# EAGLE design Rwanda-AC-CurrentSense (EAGLE 9.6.2)
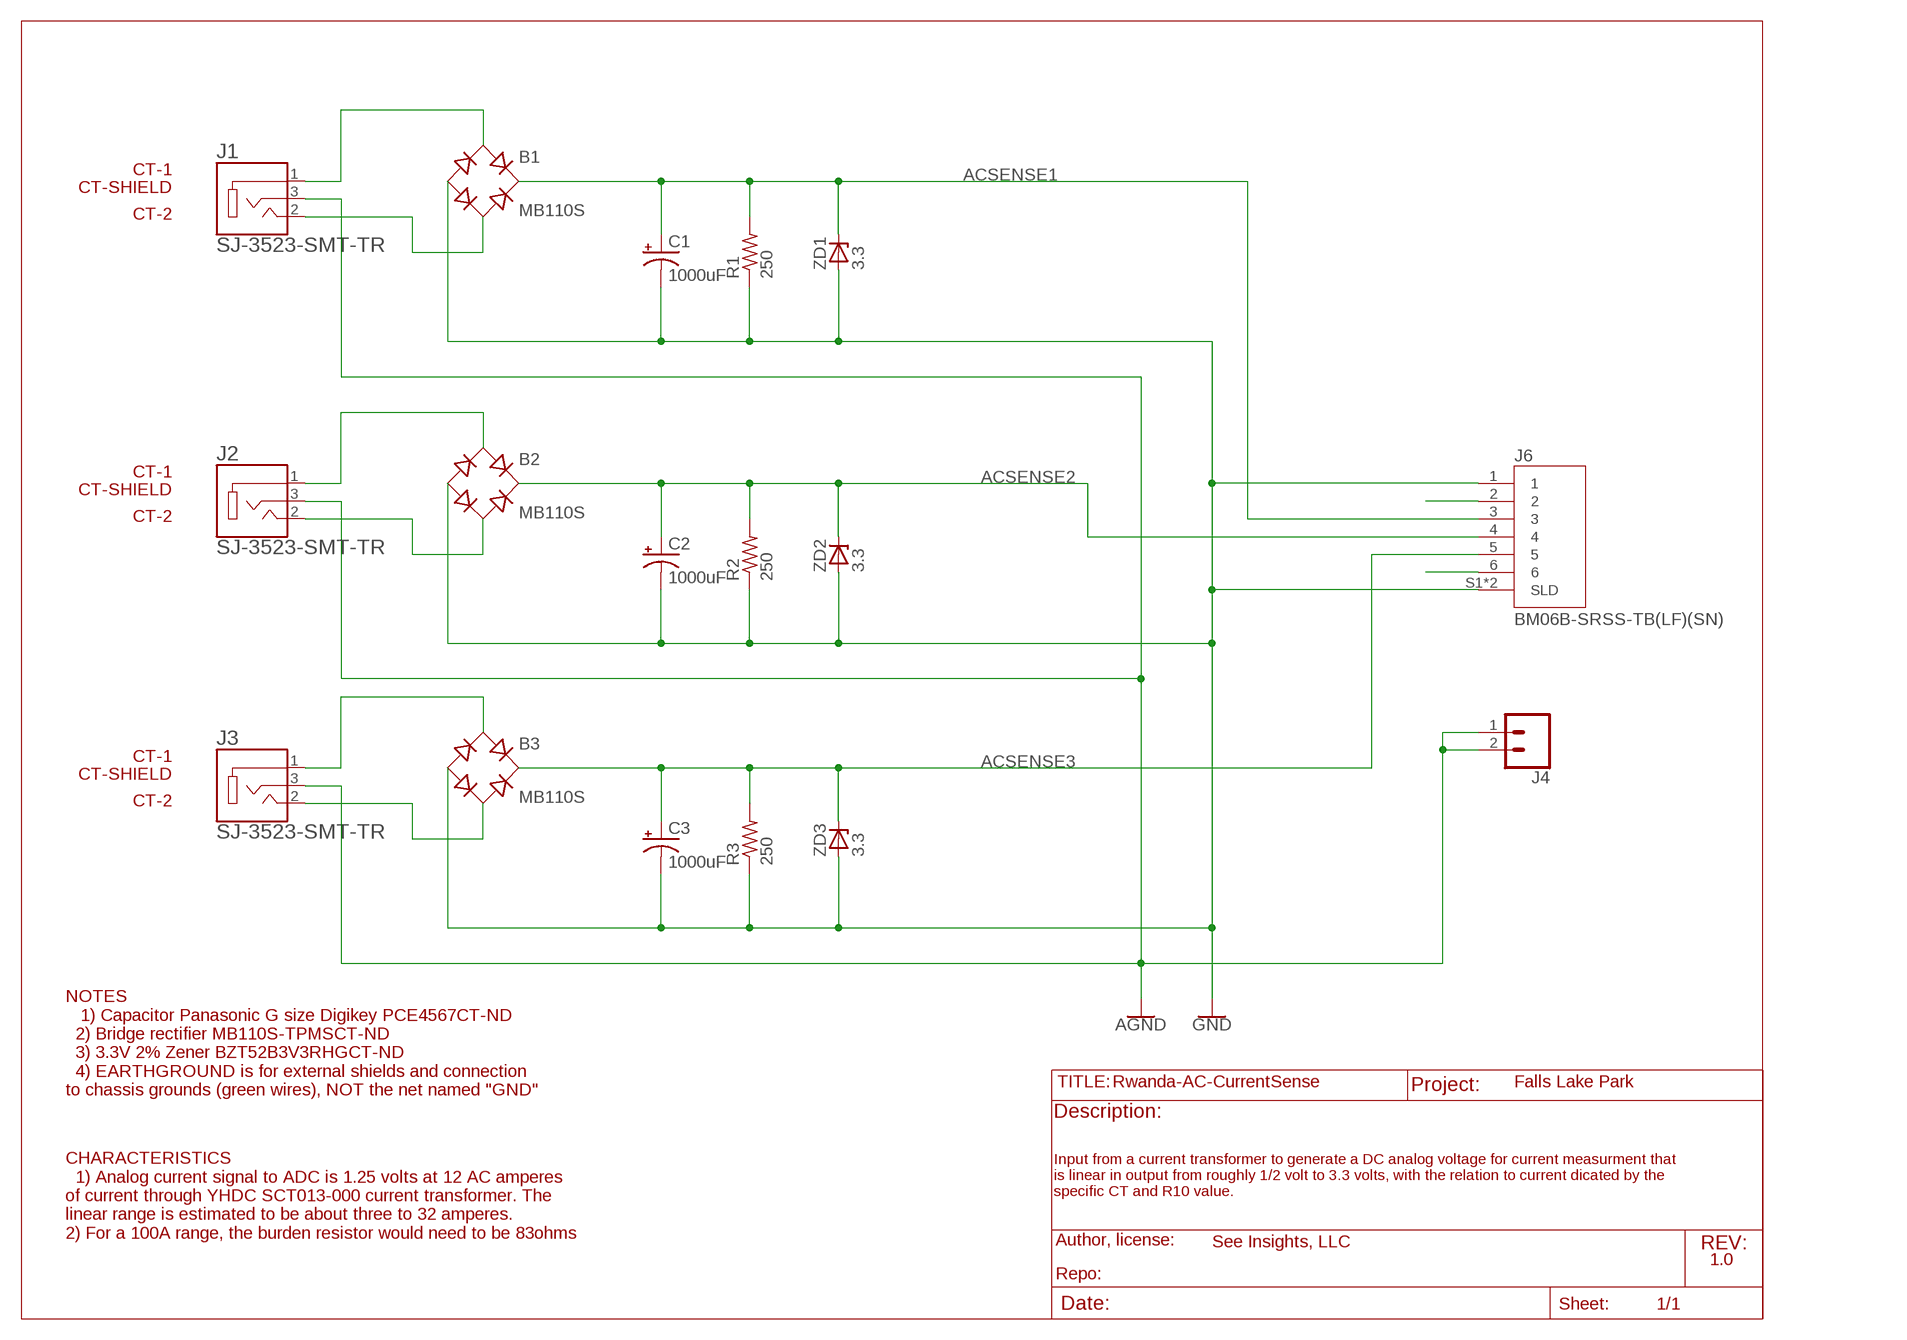
[diagram p0: schematic, sheet 1]

## Parts
B1  MB110S  MB1S  [SOIC-4]
B2  MB110S  MB1S  [SOIC-4]
B3  MB110S  MB1S  [SOIC-4]
C1  1000uF  CPOL-USG  [PANASONIC_G]
C2  1000uF  CPOL-USG  [PANASONIC_G]
C3  1000uF  CPOL-USG  [PANASONIC_G]
J1  SJ-3523-SMT-TR  [CUI_SJ-3523-SMT-TR]
J2  SJ-3523-SMT-TR  [CUI_SJ-3523-SMT-TR]
J3  SJ-3523-SMT-TR  [CUI_SJ-3523-SMT-TR]
J4  CONN_02  [1X02]
J6  BM06B-SRSS-TB(LF)(SN)  [JST_BM06B-SRSS-TB(LF)(SN)]
R1  250  R-US_M1206  [M1206]
R2  250  R-US_M1206  [M1206]
R3  250  R-US_M1206  [M1206]
ZD1  3.3  ZD-SOD123  [SOD123]
ZD2  3.3  ZD-SOD123  [SOD123]
ZD3  3.3  ZD-SOD123  [SOD123]

## Nets
ACSENSE1: B1.+ C1.+ J6.3 R1.2 ZD1.C
ACSENSE2: B2.+ C2.+ J6.4 R2.2 ZD2.C
ACSENSE3: B3.+ C3.+ J6.5 R3.2 ZD3.C
GND: B1.- B2.- B3.- C1.- C2.- C3.- J6.1 J6.S1(SLD) J6.S2(SLD) R1.1 R2.1 R3.1 ZD1.A ZD2.A ZD3.A
N$2: B2.~2(AC2) J2.2
N$4: B2.~1(AC1) J2.1
N$6: B1.~2(AC2) J1.2
N$7: B1.~1(AC1) J1.1
N$11: B3.~2(AC2) J3.2
N$12: B3.~1(AC1) J3.1
N$15: J6.2
N$19: J6.6
SHEILD: J1.3 J2.3 J3.3 J4.1 J4.2 ; supply symbol labelled AGND

## Notes on the sheet
- CT-1
- CT-SHIELD
- CT-2
- CT-1
- CT-SHIELD
- CT-2
- CT-1
- CT-SHIELD
- CT-2
- Falls Lake Park
- NOTES
     1) Capacitor Panasonic G size Digikey PCE4567CT-ND
    2) Bridge rectifier MB110S-TPMSCT-ND
    3) 3.3V 2% Zener BZT52B3V3RHGCT-ND
    4) EARTHGROUND is for external shields and connection
  to chassis grounds (green wires), NOT the net named "GND"
- CHARACTERISTICS
    1) Analog current signal to ADC is 1.25 volts at 12 AC amperes
  of current through YHDC SCT013-000 current transformer. The
  linear range is estimated to be about three to 32 amperes.
  2) For a 100A range, the burden resistor would need to be 83ohms
- Input from a current transformer to generate a DC analog voltage for current measurment that
  is linear in output from roughly 1/2 volt to 3.3 volts, with the relation to current dicated by the 
  specific CT and R10 value.
- See Insights, LLC
- 1.0

## Library data of the parts
B1 = rectifier:MB*S: Bridge Rectifier Source: http://www.fairchildsemi.com/ds/MB/MB6S.pdf; MPN: MB1S; POPULATE: 1
B2 B3 = rectifier:MB*S: Bridge Rectifier Source: http://www.fairchildsemi.com/ds/MB/MB6S.pdf
C1-C3 = adafruit:CPOL-US: POLARIZED CAPACITOR, American symbol
J1-J3 = SJ-3523-SMT-TR:SJ-3523-SMT-TR: Audio Jack Connector 3.5 mm Low Profile Surface Mount Stereo Jack, 3 Pin Right-Angle; CUI_PURCHASE_URL: https://www.cui.com/product/interconnect/audio-connectors/3.5-mm-jacks/sj-352x-smt-series?utm_source=snapeda.com&utm_medium=referral&utm_campaign=snapedaBOM; DESCRIPTION: SJ Series 3.5 mm 12 V SMT Right Angle Stereo Audio Jack; DIGI-KEY_PART_NUMBER: CP-3523SJCT-ND; DIGI-KEY_PURCHASE_URL: https://www.digikey.com/product-detail/en/cui-inc/SJ-3523-SMT-TR/CP-3523SJCT-ND/669704?utm_source=snapeda&utm_medium=aggregator&utm_campaign=symbol; MF: CUI Inc.; MP: SJ-3523-SMT-TR; PACKAGE: LGA-10 STMicroelectronics
J4 = SparkFun-Connectors:CONN_02: Multi connection point. Often used as Generic Header-pin footprint for 0.1 inch spaced/style header connections On any of the 0.1 inch spaced packages, you can populate with these: Break Away Headers - Straight <https://www.sparkfun.com/products/116> (PRT-00116) Break Away Male Headers - Right Angle <https://www.sparkfun.com/products/553> (PRT-00553) Female Headers <https://www.sparkfun.com/products/115> (PRT-00115) Break Away Headers - Machine Pin <https://www.sparkfun.com/products/117> (PRT-00117) Break Away Female Headers - Swiss Machine Pin <https://www.sparkfun.com/products/743> (PRT-00743) For SCREWTERMINALS and SPRING TERMINALS visit here: Screw Terimnals on SparkFun.com <https://www.sparkfun.com/search/results?term=Screw+Terminals> (5mm/3.5mm/2.54mm spacing) This device is also useful as a general connection point to wire up your design to another part of your project. Our various solder wires solder well into these plated through hole pads. Hook-Up Wire - Assortment (Stranded, 22 AWG) <https://www.sparkfun.com/products/11375> (PRT-11375) Hook-Up Wire - Assortment (Solid Core, 22 AWG) <https://www.sparkfun.com/products/11367> (PRT-11367) View the entire wire category on our website here <https://www.sparkfun.com/categories/141> Special notes: Molex polarized connector foot print use with: PRT-08233 with associated crimp pins and housings. 2.54_SCREWTERM for use with PRT-10571. 3.5mm Screw Terminal footprints for PRT-08084 5mm Screw Terminal footprints for use with PRT-08432
J6 = Custom Components:BM06B-SRSS-TB(LF)(SN): 6 Position 1.0mm Top-Entry Surface Mount Shrouded Header; MPN: BM06B-SRSS-TB(LF)(SN); POPULATE: 1
R1 R2 = adafruit:R-US_: RESISTOR, American symbol
R3 = adafruit:R-US_: RESISTOR, American symbol; MPN: CR1206-FX-2202ELF; POPULATE: 1
ZD1 ZD2 = halfkop-diodes:ZD-: Zener diode
ZD3 = halfkop-diodes:ZD-: Zener diode; MPN: BZT52B3V3 RHG; POPULATE: 1

## Net classes
0 default: width 0.305 mm
1 AC: width 0.305 mm
2 SENSE: width 0.305 mm
3 GND: width 0.305 mm

## Board
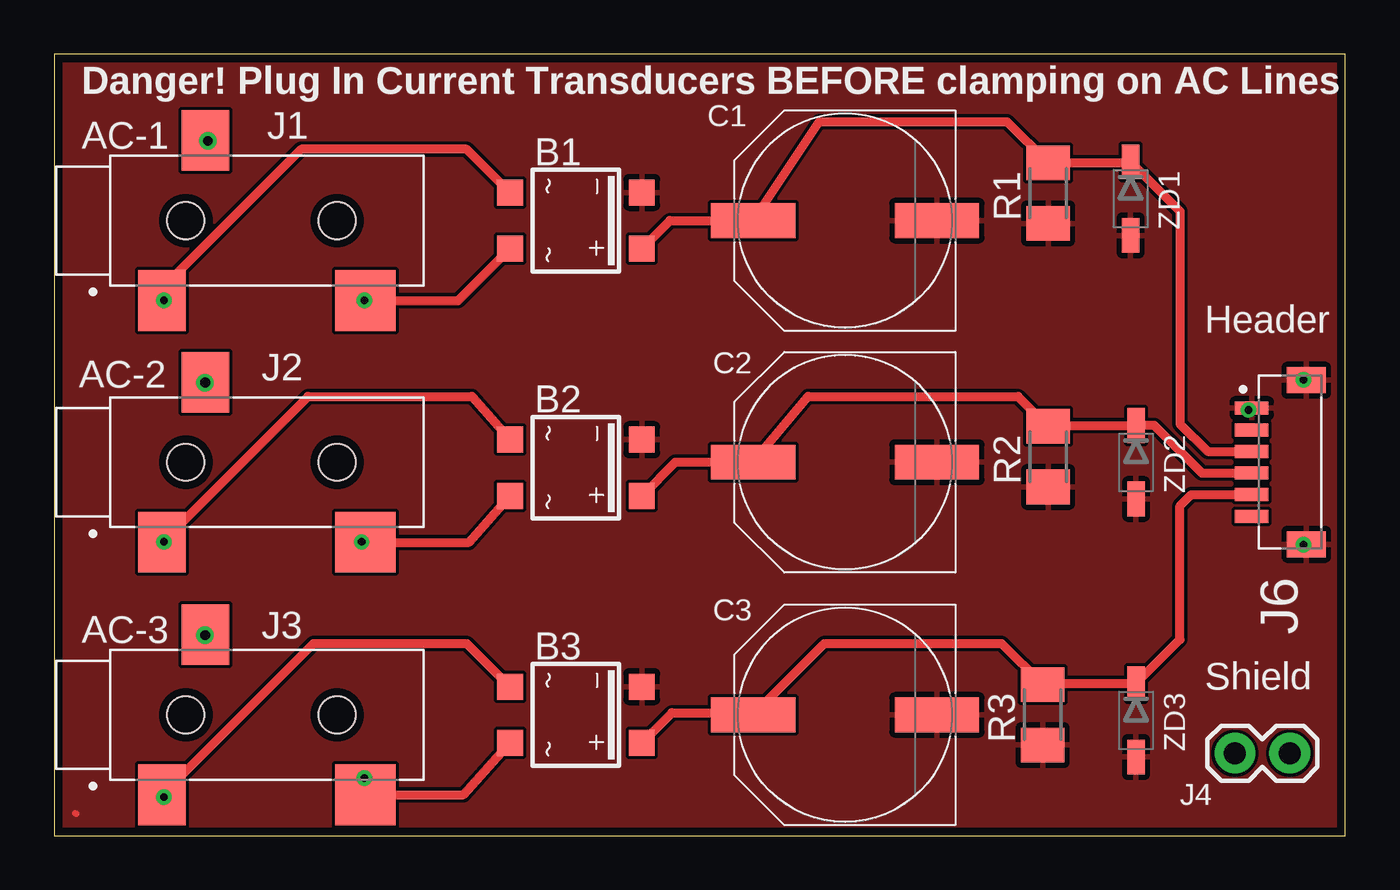
[diagram p1: board, top side]
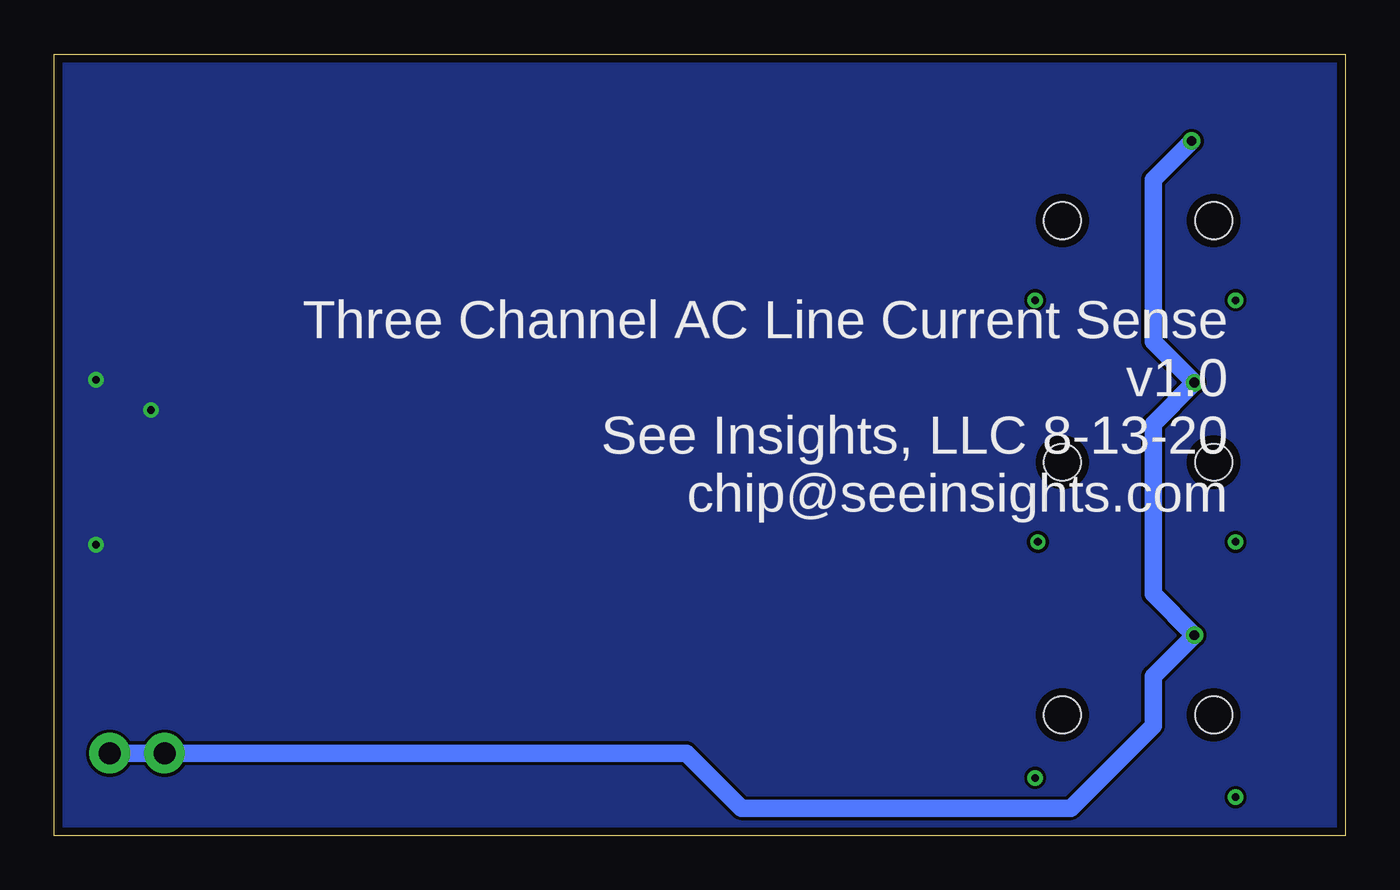
[diagram p2: board, bottom side, seen from below]

Size 59.72 x 36.15 mm. Coordinates in mm from the lower left corner, seen from the top.
Outline: 0,0 59.72,0 59.72,36.15 0,36.15 0,0
Copper layers (1*16): Top 0.0356mm / dielectric 1.5011mm / Bottom 0.0356mm
Design rules "oshpark-2layer": minimum track width 6mil, minimum drill 13mil, track to track 6mil, track to pad 6mil, pad to pad 6mil, via to via 6mil, smd to smd 6mil, copper to edge 15mil, drill to drill 6mil, minimum pad ring 7mil, minimum via ring 7mil, stop-mask expansion 2.5mil, vias tented up to drill 0mil, thermal gap 10mil

### Footprints (pad centres in the part's own frame; a part is rotated, then mirrored left to right if it is on the bottom)
SOIC-4 = smd 1.2 x 1.2: + 1.3,3.05; - -1.3,3.05; ~1 -1.3,-3.05; ~2 1.3,-3.05
PANASONIC_G = smd 3.9 x 1.6: + 4.25,0; - -4.25,0
CUI_SJ-3523-SMT-TR = smd 2.2 x 2.8: 1 -1.1,-3.7; 3 0.9,3.7 | smd 2.8 x 2.8: 2 8.3,-3.7 | hole 1.7: 0,0; 7,0
1X02 = drill 1.016 pad 1.88: 1 0,0; 2 2.54,0
JST_BM06B-SRSS-TB(LF)(SN) = smd 0.6 x 1.55: 1 -2.5,-2.525; 2 -1.5,-2.525; 3 -0.5,-2.525; 4 0.5,-2.525; 5 1.5,-2.525; 6 2.5,-2.525 | smd 1.2 x 1.8: S1 -3.8,0; S2 3.8,0
M1206 = smd 1.6 x 2: 1 -1.4,0; 2 1.4,0
SOD123 = smd 1.6 x 0.8: A 1.7,0; C -1.7,0

### Placement (x,y rotation side)
B1  24.13,28.45 270 top
B2  24.13,17.02 270 top
B3  24.13,5.59 270 top
C1  36.58,28.45 180 top
C2  36.58,17.27 180 top
C3  36.58,5.59 180 top
J1  6.1,28.45 0 top
J2  6.1,17.27 0 top
J3  6.1,5.59 0 top
J4  54.61,3.81 0 top
J6  57.91,17.27 270 top
R1  45.97,29.72 90 top
R2  45.97,17.53 90 top
R3  45.72,5.59 90 top
ZD1  49.78,29.46 270 top
ZD2  50.04,17.27 270 top
ZD3  50.04,5.33 270 top

### Tracks (layer width: path | path; a pad name or v marks a point on that pad's centre or on a via)
ACSENSE1
  Top 0.406: J6.3 53.35,17.77 52.07,19.05 52.07,28.88 ZD1.C 49.74,31.12 R1.2 44.07,33.02 35.37,33.02 C1.+ 28.48,28.45 B1.+
ACSENSE2
  Top 0.406: J6.4 55.38,16.76 53.09,16.76 50.88,18.97 ZD2.C 46.02,18.97 R2.2 44.58,20.32 34.87,20.32 C2.+ 28.73,17.27 B2.+
ACSENSE3
  Top 0.406: C3.+ 32.42,5.68 | 32.42,5.68 35.63,8.89 43.82,8.89 R3.2 45.77,7.03 ZD3.C 52.07,9.07 52.07,15.24 52.6,15.77 J6.5 | B3.+ 28.57,5.68 32.42,5.68
GND  (via drill 0.35)
  Top 0.305: 0.98,1.03 1.02,1.02
  other vias: 57.78,21.08 57.78,13.46 55.24,19.68
  pour Top: -2.29,38.61 62.99,38.61 62.99,-3.3 -2.29,-3.3
  pour Bottom: -2.79,39.37 63.75,39.37 63.75,-4.06 -2.79,-4.06
N$2  (via drill 0.35)
  Top 0.406: B2.~2 19.19,13.57 J2.2 14.24,13.57 v14.22,13.59
N$4  (via drill 0.35)
  Top 0.406: B2.~1 19.33,20.32 11.74,20.32 J2.1 5.01,13.59 v5.08,13.59
N$6  (via drill 0.35)
  Top 0.406: B1.~2 18.68,24.75 J1.2 14.37,24.75 v14.35,24.77
N$7  (via drill 0.35)
  Top 0.406: B1.~1 19.08,31.75 11.43,31.75 5,25.32 J1.1 5.01,24.77 v5.08,24.77
N$11  (via drill 0.35)
  Top 0.406: B3.~2 18.93,1.89 J3.2 14.35,1.93 v14.35,2.67
N$12  (via drill 0.35)
  Top 0.406: B3.~1 19.08,8.89 12,8.89 J3.1 5.08,1.8 v5.08,1.78
SHEILD  (via drill 0.45)
  Top 0.406: J3.3 v6.99,9.28 v6.99,9.27 | J2.3 v6.99,20.95
  Top 0.813: J1.3 7.01,32.13 v7.11,32.13
  Bottom 0.813: v7.11,32.13 8.89,30.35 8.89,22.86 v6.99,20.95 8.89,19.05 8.89,11.18 v6.99,9.27 8.89,7.37 8.89,5.08 12.7,1.27 27.94,1.27 30.48,3.81 J4.1 J4.2

### Text on the board
tNames: Danger! Plug In Current Transducers BEFORE clamping on AC Lines | AC-1 | Header | AC-2 | AC-3 | Shield
bNames: Three Channel AC Line Current Sense / v1.0 / See Insights, LLC 8-13-20 / chip@seeinsights.com